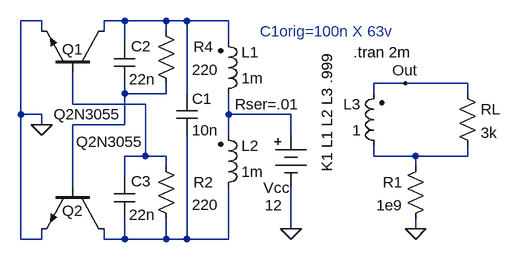
[diagram p0: schematic 12vFluoPpConvert.asc]
12vFluoPpConvert.asc, the LTspice schematic file:
Version 4
SHEET 1 880 680
WIRE -512 112 -544 112
WIRE -384 112 -416 112
WIRE -320 112 -384 112
WIRE -288 112 -320 112
WIRE -224 112 -288 112
WIRE -512 128 -512 112
WIRE -416 128 -416 112
WIRE -320 128 -320 112
WIRE -384 144 -384 112
WIRE -224 144 -224 112
WIRE 48 208 0 208
WIRE 144 208 48 208
WIRE -384 224 -384 208
WIRE -320 224 -320 208
WIRE -320 224 -384 224
WIRE -288 224 -288 112
WIRE 0 224 0 208
WIRE 144 224 144 208
WIRE -464 240 -464 192
WIRE -352 240 -464 240
WIRE -544 256 -544 112
WIRE -512 256 -544 256
WIRE -224 256 -224 224
WIRE -128 256 -224 256
WIRE -512 272 -512 256
WIRE -384 272 -384 224
WIRE -384 272 -464 272
WIRE -224 288 -224 256
WIRE -128 288 -128 256
WIRE -352 320 -352 240
WIRE -352 320 -384 320
WIRE -320 320 -352 320
WIRE 0 320 0 304
WIRE 64 320 0 320
WIRE 144 320 144 304
WIRE 144 320 64 320
WIRE -320 336 -320 320
WIRE 64 336 64 320
WIRE -384 352 -384 320
WIRE -464 368 -464 272
WIRE -128 432 -128 368
WIRE 64 432 64 416
WIRE -544 448 -544 256
WIRE -512 448 -512 432
WIRE -512 448 -544 448
WIRE -416 448 -416 432
WIRE -384 448 -384 416
WIRE -384 448 -416 448
WIRE -320 448 -320 416
WIRE -320 448 -384 448
WIRE -288 448 -288 288
WIRE -288 448 -320 448
WIRE -224 448 -224 368
WIRE -224 448 -288 448
FLAG 64 432 0
FLAG -128 432 0
FLAG -512 272 0
FLAG 48 208 Out
SYMBOL ind2 -240 240 M180
WINDOW 0 36 80 Left 0
WINDOW 3 36 40 Left 0
SYMATTR InstName L1
SYMATTR Value 1m
SYMBOL ind2 -240 384 M180
WINDOW 0 36 80 Left 0
WINDOW 3 36 40 Left 0
SYMATTR InstName L2
SYMATTR Value 1m
SYMBOL ind2 16 320 R180
WINDOW 0 36 80 Left 0
WINDOW 3 36 40 Left 0
SYMATTR InstName L3
SYMATTR Value 1
SYMATTR SpiceLine Rser=1
SYMBOL res 80 320 M0
SYMATTR InstName R1
SYMATTR Value 1e9
SYMBOL npn2 -416 192 M270
WINDOW 0 36 64 VLeft 0
WINDOW 3 -64 77 VLeft 0
SYMATTR InstName Q1
SYMATTR Value Q2N3055
SYMBOL cap -304 224 R0
SYMATTR InstName C1
SYMATTR Value 10n
SYMBOL cap -368 208 R180
WINDOW 0 -25 57 Left 0
WINDOW 3 -31 6 Left 0
SYMATTR InstName C2
SYMATTR Value 22n
SYMBOL res -336 320 R0
WINDOW 0 58 40 Left 0
WINDOW 3 56 75 Left 0
SYMATTR InstName R2
SYMATTR Value 220
SYMBOL Misc\\battery -128 272 R0
WINDOW 0 -42 97 Left 0
WINDOW 3 -40 124 Left 0
WINDOW 123 0 0 Left 0
WINDOW 39 -86 -32 Left 0
SYMATTR InstName Vcc
SYMATTR Value 12
SYMATTR SpiceLine Rser=.01
SYMBOL res 128 208 R0
SYMATTR InstName RL
SYMATTR Value 3k
SYMBOL npn2 -416 368 R90
WINDOW 0 36 64 VLeft 0
WINDOW 3 -70 43 VLeft 0
SYMATTR InstName Q2
SYMATTR Value Q2N3055
SYMBOL res -336 112 R0
WINDOW 0 58 40 Left 0
WINDOW 3 56 75 Left 0
SYMATTR InstName R4
SYMATTR Value 220
SYMBOL cap -368 416 R180
WINDOW 0 -25 57 Left 0
WINDOW 3 -31 6 Left 0
SYMATTR InstName C3
SYMATTR Value 22n
TEXT -72 160 VRight 0 !K1 L1 L2 L3 .999
TEXT -32 160 Left 0 !.tran 2m
TEXT -176 128 Left 0 ;C1orig=100n X 63v

The netlist it stands for:
* 12vFluoPpConvert.asc
L1 N004 N001 1m
L2 N006 N004 1m
L3 N005 Out 1 Rser=1
R1 N005 0 1e9
Q1 N001 N003 0 0 Q2N3055
C1 N001 N006 10n
C2 N002 N001 22n
R2 N003 N006 220
Vcc N004 0 12 Rser=.01
RL Out N005 3k
Q2 N006 N002 0 0 Q2N3055
R4 N001 N002 220
C3 N006 N003 22n
.model NPN NPN
.model PNP PNP
.lib standard.bjt
K1 L1 L2 L3 .999
.tran 2m
* C1orig=100n X 63v
.backanno
.end